# EAGLE design DebugBoard (EAGLE 5.11)
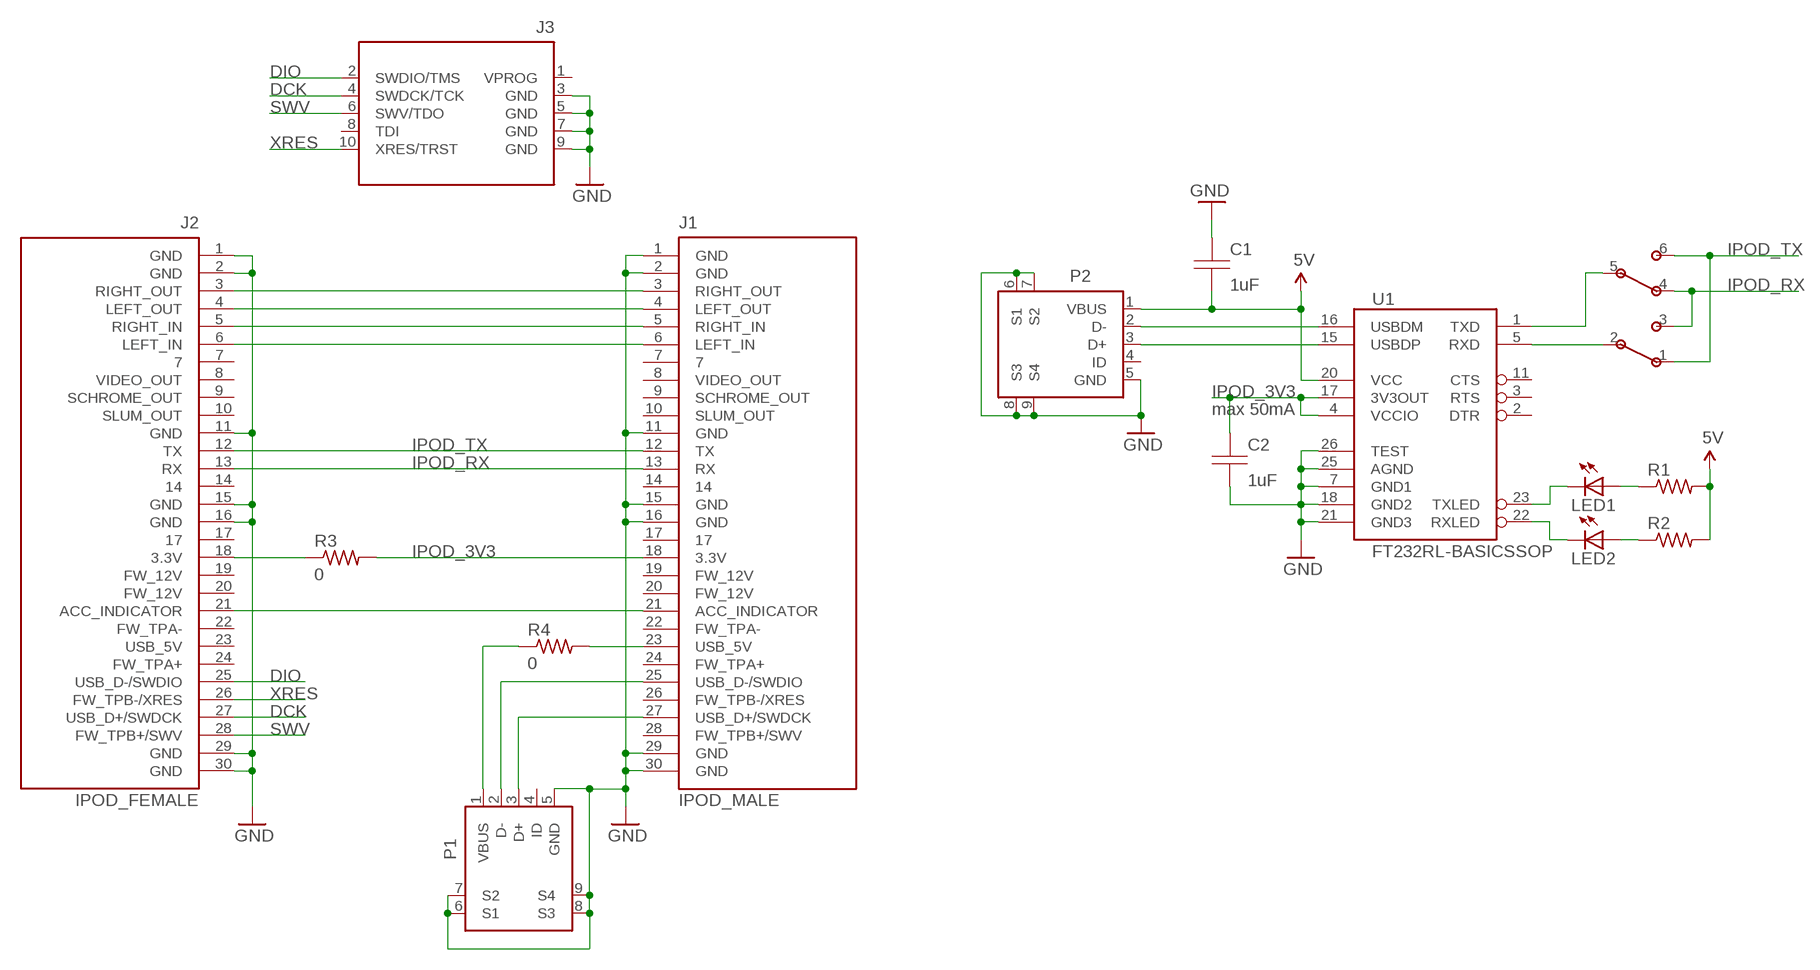
[diagram p0: schematic, sheet 1]

## Parts
C1  1uF  CAPACITOR0402  [0402]
C2  1uF  CAPACITOR0402  [0402]
J1  IPOD_MALE  IPOD_CONNECTOR_MALE_4  [IPOD_CONNECTOR_MALE_4]
J2  IPOD_FEMALE  IPOD_CONNECTOR_FEMALE  [IPOD_CONNECTOR_FEMALE]
J3  JTAG_SAMTEC_2X5  [JTAG_SAMTEC_2X5]
LED1  LED0603  [LED-0603]
LED2  LED0603  [LED-0603]
P1  USB_MICROB_POWER  [USB_MICROB_HIROSE_ZX62R-R-5P_POWER]
P2  USB_MICROB_POWER  [USB_MICROB_HIROSE_ZX62R-R-5P_POWER]
R1  R0603  [0603]
R2  R0603  [0603]
R3  0  R0603  [0603]
R4  0  R0603  [0603]
SW1  SWITCH_DOUBLE_JS202011SCQN  [SWITCH_DOUBLE_JS202011SCQN]
U1  FT232RL-BASICSSOP  [SSOP28DB]

## Nets
5V: C1.1 P2.1(VBUS) R1.2 R2.2 U1.20(VCC)
D+: J1.27(USB_D+/SWDCK) P1.3(D+)
D-: J1.25(USB_D-/SWDIO) P1.2(D-)
DCK: J2.27(USB_D+/SWDCK) J3.4(SWDCK/TCK)
DIO: J2.25(USB_D-/SWDIO) J3.2(SWDIO/TMS)
FD+: P2.3(D+) U1.15(USBDP)
FD-: P2.2(D-) U1.16(USBDM)
GND: C1.2 C2.1 J1.1(GND) J1.2(GND) J1.11(GND) J1.15(GND) J1.16(GND) J1.29(GND) J1.30(GND) J2.1(GND) J2.2(GND) J2.11(GND) J2.15(GND) J2.16(GND) J2.29(GND) J2.30(GND) J3.3(GND) J3.5(GND) J3.7(GND) J3.9(GND) P1.5(GND) P1.6(S1) P1.7(S2) P1.8(S3) P1.9(S4) P2.5(GND) P2.6(S1) P2.7(S2) P2.8(S3) P2.9(S4) U1.7(GND1) U1.18(GND2) U1.21(GND3) U1.25(AGND) U1.26(TEST)
IPOD_3V3: C2.2 J1.18(3.3V) R3.2 U1.4(VCCIO) U1.17(3V3OUT)
IPOD_RX: J1.13(RX) J2.13(RX) SW1.3 SW1.4
IPOD_TX: J1.12(TX) J2.12(TX) SW1.1 SW1.6
N$1: J2.18(3.3V) R3.1
N$2: J1.23(USB_5V) R4.2
N$3: J1.3(RIGHT_OUT) J2.3(RIGHT_OUT)
N$4: J1.4(LEFT_OUT) J2.4(LEFT_OUT)
N$5: J1.5(RIGHT_IN) J2.5(RIGHT_IN)
N$6: LED1.A R1.1
N$7: SW1.5 U1.1(TXD)
N$8: J1.6(LEFT_IN) J2.6(LEFT_IN)
N$11: SW1.2 U1.5(RXD)
N$12: J1.21(ACC_INDICATOR) J2.21(ACC_INDICATOR)
N$13: LED1.C U1.23(TXLED)
N$14: LED2.C U1.22(RXLED)
N$15: LED2.A R2.1
SWV: J2.28(FW_TPB+/SWV) J3.6(SWV/TDO)
USB_5V: P1.1(VBUS) R4.1
XRES: J2.26(FW_TPB-/XRES) J3.10(XRES/TRST)
Unconnected: J1.7 J1.8(VIDEO_OUT) J1.9(SCHROME_OUT) J1.10(SLUM_OUT) J1.14 J1.17 J1.19(FW_12V) J1.20(FW_12V) J1.22(FW_TPA-) J1.24(FW_TPA+) J1.26(FW_TPB-/XRES) J1.28(FW_TPB+/SWV) J2.7 J2.8(VIDEO_OUT) J2.9(SCHROME_OUT) J2.10(SLUM_OUT) J2.14 J2.17 J2.19(FW_12V) J2.20(FW_12V) J2.22(FW_TPA-) J2.23(USB_5V) J2.24(FW_TPA+) J3.8(TDI) P1.4(ID) P2.4(ID) U1.2(DTR) U1.3(RTS) U1.11(CTS)

## Notes on the sheet
- max 50mA

## Power pins joined to a net without a drawn wire
VPROG: J3.1(VPROG)

## Library data of the parts
C1 C2 = PSoC:CAPACITOR
J1 J2 = PSoC:IPOD_CONNECTOR
J3 = PSoC:JTAG_SAMTEC_2X5: http://www.samtec.com/ftppub/pdf/ftsh_mt.pdf http://www.cypress.com/?docID=18351
LED1 LED2 = SparkFun:LED: LEDs Standard schematic elements and footprints for 5mm, 3mm, 1206, and 0603 sized LEDs. 5mm - Spark Fun Electronics SKU : COM-00529 (and others)
P1 P2 = PSoC:USB_MICROB: http://www.hirose.co.jp/cataloge_hp/e24200011.pdf Hirose ZX62R-B-5P
R1-R4 = PSoC:R: http://industrial.panasonic.com/www-data/pdf/AOA0000/AOA0000PE32.pdf
SW1 = PSoC:SWITCH_DOUBLE_JS202011SCQN: http://www.ck-components.com/14398/js_7jan.pdf/
U1 = SparkFun:FT232RL-BASIC: USB UART This is the simplified version of the FT232RL unit. Only what you need, nothing you don't. Spark Fun Electronics SKU : COM-00650

## Board
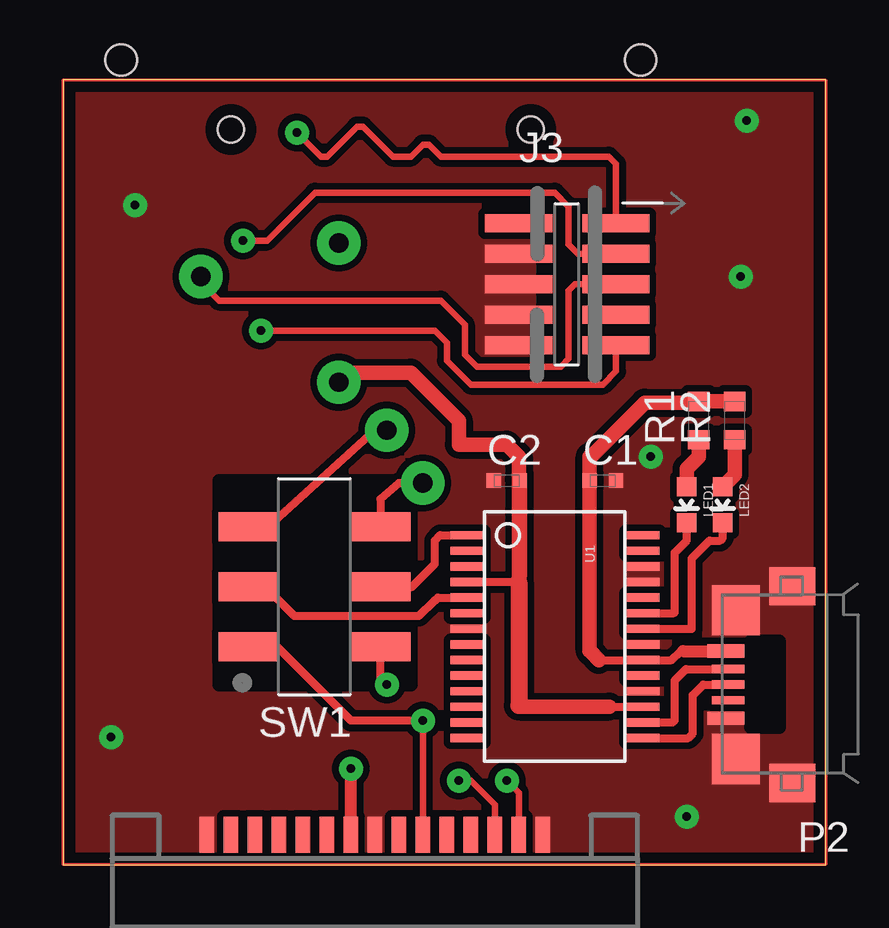
[diagram p1: board, top side]
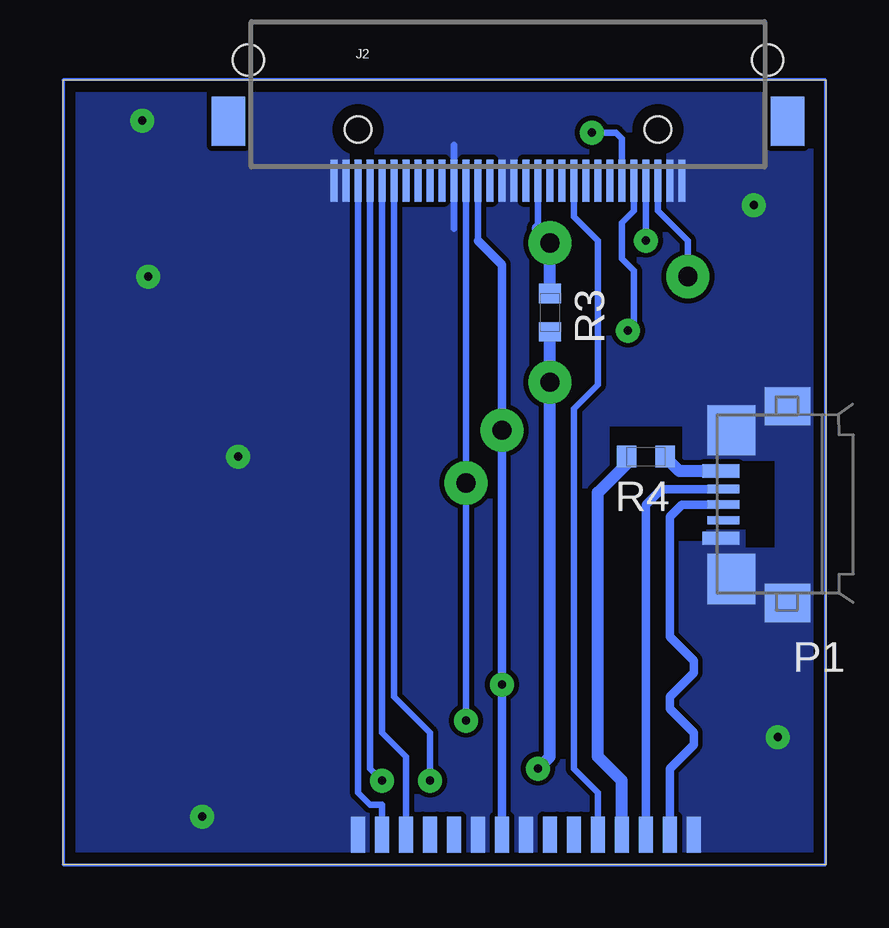
[diagram p2: board, bottom side, seen from below]

Size 31.8 x 32.7 mm. Coordinates in mm from the lower left corner, seen from the top.
Outline: 0,0 31.8,0 31.8,32.7 0,32.7 0,0
Copper layers (1*16): Top 0.035mm / dielectric 1.5mm / Bottom 0.035mm
Design rules "default *": minimum track width 8mil, minimum drill 0.35mm, track to track 8mil, track to pad 8mil, pad to pad 8mil, via to via 8mil, smd to smd 8mil, copper to edge 20mil, drill to drill 16mil, minimum pad ring 10mil, minimum via ring 8mil, stop-mask expansion 4mil, vias tented up to drill 0mil, thermal gap 10mil
tRestrict: area 6.5,7.5 to 14.5,16; area 20,20.5 to 22,27.5
bRestrict: area 6,15.2 to 9,18.2; area 10.5,21 to 12.4,25; area 5,13.5 to 6.5,14.5

### Footprints (pad centres in the part's own frame; a part is rotated, then mirrored left to right if it is on the bottom)
0402 = smd 0.6 x 0.6: 1 -0.55,0; 2 0.55,0
IPOD_CONNECTOR_MALE_4 = smd 0.6 x 1.5 bottom: 1 -6.5,0; 3 -5.5,0; 5 -4.5,0; 7 -3.5,0; 9 -2.5,0; 11 -1.5,0; 13 -0.5,0; 15 0.5,0; 17 1.5,0; 19 2.5,0; 21 3.5,0; 23 4.5,0; 25 5.5,0; 27 6.5,0; 29 7.5,0 | smd 0.6 x 1.5: 2 -7,0; 4 -6,0; 6 -5,0; 8 -4,0; 10 -3,0; 12 -2,0; 14 -1,0; 16 0,0; 18 1,0; 20 2,0; 22 3,0; 24 4,0; 26 5,0; 28 6,0; 30 7,0
IPOD_CONNECTOR_FEMALE = smd 0.28 x 1.75: 1 -7.25,0; 2 -6.75,0; 3 -6.25,0; 4 -5.75,0; 5 -5.25,0; 6 -4.75,0; 7 -4.25,0; 8 -3.75,0; 9 -3.25,0; 10 -2.75,0; 11 -2.25,0; 12 -1.75,0; 13 -1.25,0; 14 -0.75,0; 15 -0.25,0; 16 0.25,0; 17 0.75,0; 18 1.25,0; 19 1.75,0; 20 2.25,0; 21 2.75,0; 22 3.25,0; 23 3.75,0; 24 4.25,0; 25 4.75,0; 26 5.25,0; 27 5.75,0; 28 6.25,0; 29 6.75,0; 30 7.25,0 | smd 1.4 x 2.05: 31 -11.65,2.475; 32 11.65,2.475 | hole 1.1: 6.25,2.125; -6.25,2.125 | hole 1.3: 10.825,5.025; -10.825,5.025
JTAG_SAMTEC_2X5 = smd 0.74 x 2.8: 1 -2.54,-1.905; 2 -2.54,2.155; 3 -1.27,-1.905; 4 -1.27,2.155; 5 0,-1.905; 6 0,2.155; 7 1.27,-1.905; 8 1.27,2.155; 9 2.54,-1.905; 10 2.54,2.155
LED-0603 = smd 0.8 x 0.8: A 0,-0.75; C 0,0.75
USB_MICROB_HIROSE_ZX62R-R-5P_POWER = smd 0.55 x 1.55: 1 1.4,1.37; 5 -1.4,1.37 | smd 0.35 x 1.35: 2 0.65,1.27; 3 0,1.27; 4 -0.65,1.27 | smd 1.6 x 1.9: 6 4.1,-1.405; 8 -4.1,-1.405 | smd 2.1 x 2: 7 3.1,0.945; 9 -3.1,0.945
0603 = smd 0.8 x 0.9: 1 -0.8,0; 2 0.8,0
SWITCH_DOUBLE_JS202011SCQN = smd 1.2 x 2.5: 1 -2.5,2.75; 2 0,2.75; 3 2.5,2.75; 4 -2.5,-2.75; 5 0,-2.75; 6 2.5,-2.75
SSOP28DB = smd 0.348 x 1.397: 1 -4.225,-3.656; 2 -3.575,-3.656; 3 -2.925,-3.656; 4 -2.275,-3.656; 5 -1.625,-3.656; 6 -0.975,-3.656; 7 -0.325,-3.656; 8 0.325,-3.656; 9 0.975,-3.656; 10 1.625,-3.656; 11 2.275,-3.656; 12 2.925,-3.656; 13 3.575,-3.656; 14 4.225,-3.656; 15 4.225,3.656; 16 3.575,3.656; 17 2.925,3.656; 18 2.275,3.656; 19 1.625,3.656; 20 0.975,3.656; 21 0.325,3.656; 22 -0.325,3.656; 23 -0.975,3.656; 24 -1.625,3.656; 25 -2.275,3.656; 26 -2.925,3.656; 27 -3.575,3.656; 28 -4.225,3.656

### Placement (x,y rotation side)
C1  22.5,16 0 top
C2  18.5,16 0 top
J1  13,1.25 180 top
J2  13.25,28.5 0 bottom
J3  20.9,24.18 270 top
LED1  26,15 180 top
LED2  27.5,15 180 top
P1  3,15 90 bottom
P2  29,7.5 90 top
R1  26.5,18.5 90 top
R2  28,18.5 90 top
R3  11.5,23 270 bottom
R4  7.5,17 180 bottom
SW1  10.48,11.58 90 top
U1  20.5,9.5 270 top

### Tracks (layer width: path | path; a pad name or v marks a point on that pad's centre or on a via)
5V
  Top 0.33: 22.34,8.53 U1.20 25.37,8.52 25.75,8.9 | 25.75,8.9 25.8,8.95 | 25.75,8.9 25.85,8.9
  Top 0.5: 22.02,8.84 21.95,8.91 | 25.85,8.9 P2.1
  Top 0.6: 21.95,8.91 C1.1 21.95,17 22,17 24.25,19.25 26.45,19.25 R1.2 R2.2 | 22.02,8.84 22.34,8.53
D+
  Bottom 0.35: P1.3 6,15 6.5,14.5 6.5,9.5 5.5,8.5 5.5,8 6.5,7 6.5,6.5 5.5,5.5 5.5,5 6.5,4 J1.27
D-
  Bottom 0.35: P1.2 6.85,15.65 7.5,15 J1.25
DCK  (via drill 0.35 pad 1)
  Top 0.28: J3.4 21.47,25.45 21.08,25.84 21.08,27.42 20.5,28 10.5,28 8.5,26 v7.5,26
  Bottom 0.28: v7.5,26 J2.27
DIO  (via drill 0.35 pad 1)
  Top 0.28: J3.2 23.05,29.2 22.88,29.38 22.75,29.5 15.75,29.5 15.25,30 15,30 14.5,29.5 13.75,29.5 12.5,30.75 12.25,30.75 11,29.5 10.75,29.5 v9.75,30.5
  Bottom 0.28: v9.75,30.5 8.75,30.5 8.5,30.25 J2.25
FD+
  Top 0.33: P2.3 26.69,7.5 26.25,7.06 26.25,5.46 26.07,5.28 U1.15
FD-
  Top 0.33: U1.16 25.43,5.92 25.5,6 25.5,7.68 25.97,8.15 P2.2
GND  (via drill 0.35 pad 1)
  Bottom 0.28: 15.5,30 J2.11 15.5,26.5
  other vias: 26,2 24.5,17 28.5,31 3,27.48 2,5.31 28.25,24.5
  pour Top (isolate 0.28, no thermals): -1,34 33,34 33,-1 -1,-1
  pour Bottom (no thermals): -2,35 34,35 34,-2 -2,-2
IPOD_3V3  (via drill 0.35 pad 1, 0.8 pad 1.8)
  Top 0.3: 19.05,15.95 19,16
  Top 0.33: U1.4 19,11.78 19.05,11.78 | U1.17 22.77,6.58
  Top 0.5: J1.18 v12,4
  Top 0.6: 22.77,6.58 19.05,6.58 19,6.63 | 19,16.05 19,12 | 19,16.05 C2.2 | 19.05,15.95 19.05,12.05 19,12 | 19,12 19,11.78 | 19,16.05 19,17 18.5,17.5 16.5,17.5 16.5,18.5 14.5,20.5 11.9,20.5 v11.5,20.1
  Top 0.7: 19,11.78 19,6.63
  Bottom 0.5: R3.2 v11.5,20.1 11.5,4.5 v12,4
IPOD_RX  (via drill 0.35 pad 1, 0.8 pad 1.8)
  Top 0.33: SW1.4 13.23,7.77 v13.5,7.5 | SW1.3 8.58,14.08 13,18.1 v13.5,18.1
  Bottom 0.28: 14.5,26 J2.13
  Bottom 0.35: J1.13 v13.5,7.5 v13.5,18.1 13.5,25 14.5,26
IPOD_TX  (via drill 0.35 pad 1, 0.8 pad 1.8)
  Top 0.28: J1.12 v15,6
  Top 0.33: SW1.6 13.23,15.23 14,15.9 v15,15.9 | SW1.1 8.92,9.08 12,6 v15,6
  Bottom 0.28: v15,6 v15,15.9 J2.12
N$1  (via drill 0.8 pad 1.8)
  Bottom 0.28: 12,26.5 J2.18
  Bottom 0.5: R3.1 v11.5,25.9 12,26.5
N$2
  Bottom 0.5: J1.23 8.5,3.5 9.5,4.5 9.5,15.5 8.3,16.7 R4.2
N$3
  Bottom 0.28: J1.3 18.5,2.5 19,2.5 19.5,3 J2.3
N$4  (via drill 0.35 pad 1)
  Top 0.28: J1.4 19,3 v18.5,3.5
  Bottom 0.28: J2.4 19,4 v18.5,3.5
N$5
  Bottom 0.28: J2.5 18.5,5.5 17.5,4.5 J1.5
N$6
  Top 0.6: R1.1 26.5,17 26,16.5 LED1.A
N$7
  Top 0.33: U1.1 15.72,13.72 15.5,13.5 15.5,12.53 14.53,11.56 13.25,11.56 SW1.5
N$8  (via drill 0.35 pad 1)
  Top 0.28: J1.6 18,2.5 17,3.5 v16.5,3.5
  Bottom 0.28: J2.6 18,7 16.5,5.5 v16.5,3.5
N$11
  Top 0.33: U1.5 15.62,11.12 15.5,11 15.48,11 14.84,10.36 9.64,10.36 8.5,11.5 7.81,11.5 SW1.2
N$12
  Bottom 0.28: J1.21 9.5,3 10.25,3.75 10.5,4 10.5,19 9.5,20 9.5,26 10.5,27 J2.21
N$13
  Top 0.33: U1.23 25.48,10.47 25.5,10.5 25.5,13 26,13.5 LED1.C
N$14
  Top 0.33: U1.22 26.2,9.82 26.21,9.83 26.21,12.76 26.95,13.5 27.4,13.5 27.5,13.6 LED2.C
N$15
  Top 0.5: LED2.A
  Top 0.6: R2.1 28,16.25 LED2.A
S$1
  Top 0.127: 0,0 0,32.7 31.8,32.7 31.8,0 0,0
S$2
  Bottom 0.127: 0,0 0,32.7 31.8,32.7 31.8,0 0,0
SWV  (via drill 0.8 pad 1.8)
  Top 0.28: J3.6 21.35,24.18 21.08,23.91 21.08,21.08 20.75,20.75 17.25,20.75 16.75,21.25 16.75,22.5 15.75,23.5 6.5,23.5 5.75,24.25 v5.75,24.5
  Bottom 0.28: v5.75,24.5 5.75,26 7,27.25 J2.28
USB_5V
  Bottom 0.5: P1.1 6.1,16.4 R4.1
XRES  (via drill 0.35 pad 1)
  Top 0.28: J3.10 23.05,20.55 22.5,20 17,20 16,21 16,21.75 15.5,22.25 v8.25,22.25
  Bottom 0.28: v8.25,22.25 8,22.5 8,24.75 8.5,25.25 8.5,26.75 8,27.25 J2.26